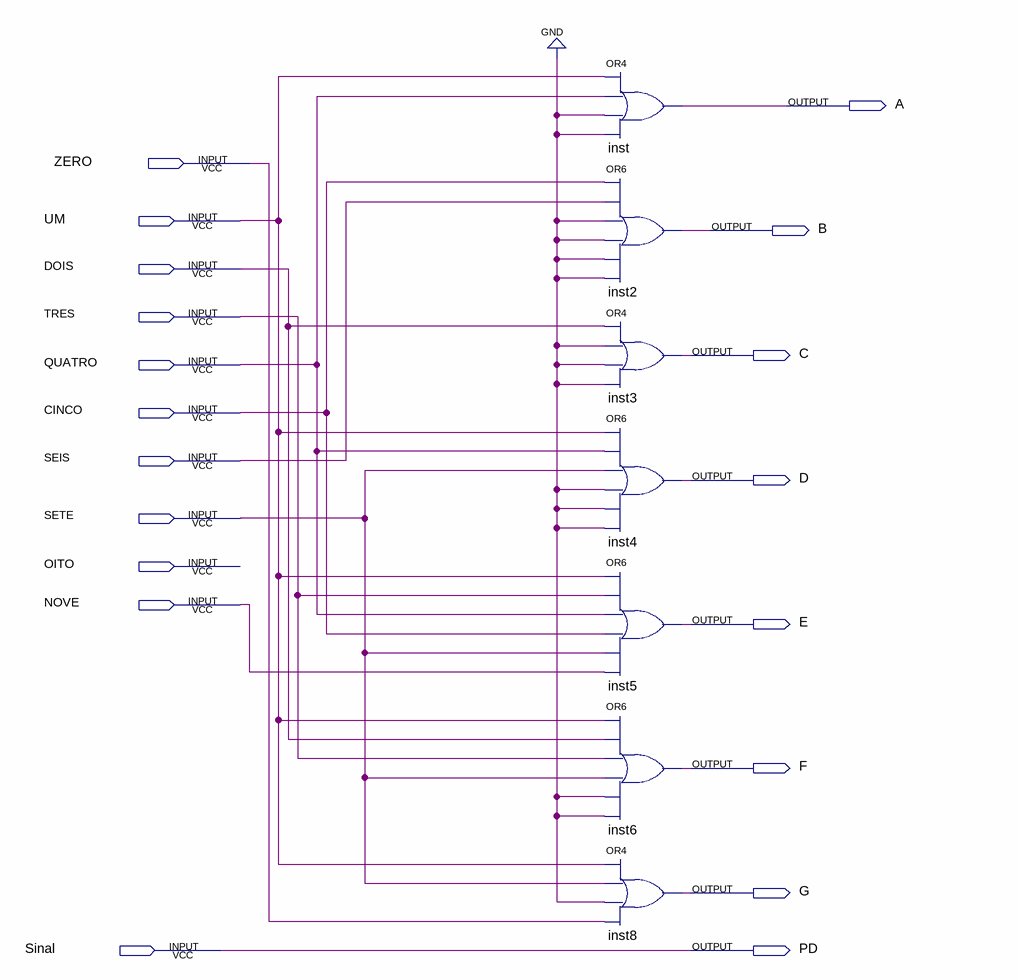
[diagram p0: schematic sheet]
// Quartus schematic SeteSegmentosController.bdf as structural Verilog: 7 symbols, 19 pins
module SeteSegmentosController (
  input  ZERO,
  input  UM,
  input  DOIS,
  input  TRES,
  input  QUATRO,
  input  CINCO,
  input  SEIS,
  input  SETE,
  input  OITO,
  input  NOVE,
  input  Sinal,
  output A,
  output B,
  output C,
  output D,
  output E,
  output F,
  output G,
  output PD
);

  or inst (A, UM, QUATRO, 1'b0, 1'b0);
  or inst2 (B, CINCO, SEIS, 1'b0, 1'b0, 1'b0, 1'b0);
  or inst3 (C, DOIS, 1'b0, 1'b0, 1'b0);
  or inst4 (D, UM, QUATRO, SETE, 1'b0, 1'b0, 1'b0);
  or inst5 (E, UM, TRES, QUATRO, CINCO, SETE, NOVE);
  or inst6 (F, UM, DOIS, TRES, SETE, 1'b0, 1'b0);
  or inst8 (G, UM, SETE, 1'b0, ZERO);

  assign PD = Sinal;
endmodule
